# Altium schematic sheet Gas_Sampler-Vin.SchDoc: Vin
size Tabloid; Organization: Sensible Robotics LLC; Address1: 120 E Church Ave Suite B; Address2: Ridgecrest CA, 93555; Revision: 0; SheetNumber: 3; SheetTotal: 12; ApprovedBy: Approved Name; Engineer: Mike Licitra; PageSetup: Record=PageOptions|CenterHorizontal=True|CenterVertical=True|PrintScale=0.98|XCorrection=1.00|YCorrection=1.00|PrintKind=0|BorderSize=5000000|LeftOffset=0|BottomOffset=0|Orientation=2|PaperLength=1000|PaperWidth=1000|Scale=100|PaperSource=15|PrintQuality=600|MediaType=1|DitherType=10|PaperKind=Tabloid|PrintScaleMode=1
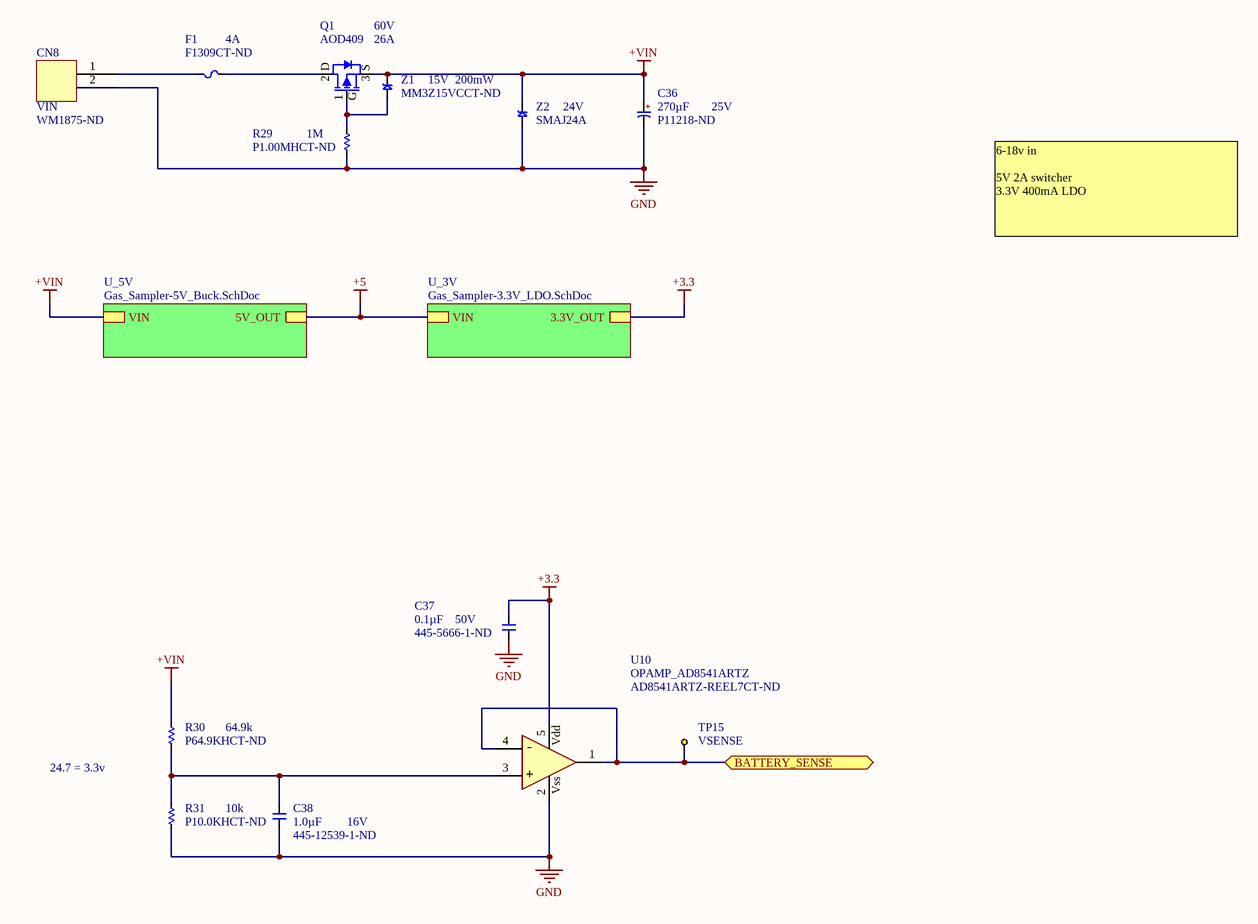
[diagram p0: Gas_Sampler-Vin.SchDoc]

## Parts
C36  value 270µF  Voltage - Rated: 25V  Supplier Part Number 1: P11218-ND  [CAP_RADIAL_10MM_DIA_12.5MM_LEN_5MM_LEADSPACE]  (hidden comment: CAP_ALUM_270UF_25V_20%_RADIAL_10X12.5MM)
C37  value 0.1µF  Voltage - Rated: 50V  Supplier Part Number 1: 445-5666-1-ND  [C0603]  (hidden comment: CAP_CER_0603_0.1UF_50V_10%_X7R)
C38  value 1.0µF  Supplier Part Number 1: 445-12539-1-ND  Voltage - Rated: 16V  [C0603]  (hidden comment: CAP_CER_0603_1UF_16V_10%_X7R)
CN8  VIN  Supplier Part Number 1: WM1875-ND  [MICROFIT_3_SINGLE_ROW_RA_TH_CLIP_2POS]
F1  Supplier Part Number 1: F1309CT-ND  Current Rating: 4A  [FUSEHOLDER_LITTLEFUSE_0154005.DR]  (hidden comment: FUSE_4A_OMNIBLOK_0154004)
Q1  Manufacturer Part Number: AOD409  Drain to Source Voltage (Vdss): 60V  Current - Continuous Drain (Id) @ 25° C: 26A  [DPAK]  (hidden comment: PFET_AOD409)
R29  value 1M  Supplier Part Number 1: P1.00MHCT-ND  [R0603]  (hidden comment: RES_0603_1M_OHM_1/10W_1%)
R30  Supplier Part Number 1: P64.9KHCT-ND  Resistance (Ohms): 64.9k  [R0603]  (hidden comment: RES_0603_64.9K_OHM_1/10W_1%)
R31  value 10k  Supplier Part Number 1: P10.0KHCT-ND  [R0603]  (hidden comment: RES_0603_10K_OHM_1/10W_1%)
TP15  VSENSE  [TP_KEYSTONE_5001]
U10  OPAMP_AD8541ARTZ  Supplier Part Number 1: AD8541ARTZ-REEL7CT-ND  [5SOT23]
Z1  Supplier Part Number 1: MM3Z15VCCT-ND  Power - Max: 200mW  Voltage - Zener (Nom) (Vz): 15V  [SOD323]  (hidden comment: ZENER_MM3Z15VC)
Z2  Voltage - Reverse Standoff (Typ): 24V  Manufacturer Part Number: SMAJ24A  [SMA]  (hidden comment: TVS_UNI_SMAJ24A)

## Sub-sheets
U_3V = Gas_Sampler-3.3V_LDO.SchDoc: VIN, 3.3V_OUT
U_5V = Gas_Sampler-5V_Buck.SchDoc: 5V_OUT, VIN

## Ports
BATTERY_SENSE

## Nets
+3.3: C37.1 U10.5(VDD) ; sheet U_3V/3.3V_OUT
+5: sheet U_5V/5V_OUT, sheet U_3V/VIN
+VIN: C36.1 Q1.3(S) R30.2 Z1.2 Z2.2 ; sheet U_5V/VIN
GND: C36.2 C37.2 C38.2 CN8.2 R29.1 R31.1 U10.2(VSS) Z2.1
BATTERY_SENSE: TP15.1 U10.1(OUT) U10.4(IN-) ; port BATTERY_SENSE
NetC38_1: C38.1 R30.1 R31.2 U10.3(IN+)
NetCN8_1: CN8.1 F1.1
NetF1_2: F1.2 Q1.2(D)
NetQ1_1: Q1.1(G) R29.2 Z1.1

## Notes on the sheet
- 6-18v in
  5V 2A switcher
  3.3V 400mA LDO
- 24.7 = 3.3v
- CONFIDENTIAL DOCUMENT
- DUPLICATION PROHIBITED
- ENGINEER
- PCB FAB #
- SCH #
- REV
- Sensible
- Robotics
- THIS DOCUMENT CONTAINS INFORMATION AND OR DATA, WHICH IS PROPRIETARY AND CONFIDENTIAL TO SENSIBLE ROBOTICS LLC.  THIS INFORMATION AND OR DATA, IS TO BE USED ONLY FOR THE BENEFIT OF THE SUPPLIER, AND IS NOT TO BE USED FOR THE BENEFIT OF OTHER PARTIES WITHOUT WRITTEN CONSENT.
- DATE
- PCB ASSY #
- SIZE
- Tabloid
- SHEET
- OF
- FILE
- (in symbol CAP_ALUM_270UF_25V_20%_RADIAL_10X12.5MM) +
- (in symbol OPAMP_AD8541ARTZ) Vdd; +; Vss

## Library data of the parts
C36 = CAP_ALUM_270UF_25V_20%_RADIAL_10X12.5MM: CAP ALUM 270UF 20% 25V RADIAL; Manufacturer: Panasonic Electronic Components; Manufacturer Part Number: EEU-FC1E271; Lifetime @ Temp.: 3000 Hrs @ 105°C; Polarization: Polar; Ripple Current - Low Frequency: 490.8mA @ 120Hz; Ripple Current - High Frequency: 755mA @ 100kHz; Supplier 1: Digi-Key; RoHS: RoHS Compliant; Category: Capacitors; Stock 1: 10830; Pricing 1: 1=0.53, 10=0.372, 100=0.2449, 500=0.18144, 1000=0.15422, 2500=0.14515, 5000=0.13608 (USD); Packaging: Bulk; Part Status: Active; Tolerance: ±20%; ESR (Equivalent Series Resistance): -; Operating Temperature: -55°C ~ 105°C; Applications: Automotive; Lead Spacing: 0.197" (5.00mm); Size / Dimension: 0.394" Dia (10.00mm); Height - Seated (Max): 0.492" (12.50mm); Mounting Type: Through Hole; Package / Case: Radial, Can; ComponentLink1URL: http://industrial.panasonic.com/www-cgi/jvcr13pz.cgi?E+PZ+3+ABA0022+EEUFC1E271+7+WW; ComponentLink1Description: http://industrial.panasonic.com/www-cgi/jvcr13pz.cgi?E+PZ+3+ABA0022+EEUFC1E271+7+WW
C37 = CAP_CER_0603_0.1UF_50V_10%_X7R: CAP CER 0.1UF 50V 10% X7R 0603; Manufacturer: TDK Corporation; Manufacturer Part Number: CGA3E2X7R1H104K080AA; Part Number: 150-00077-00; Supplier 1: Digi-Key; RoHS: RoHS Compliant; Category: Capacitors; Stock 1: 320000; Pricing 1: 1=0.1, 10=0.072, 100=0.033, 250=0.027, 500=0.0231, 1000=0.018 (USD); Packaging: Cut Tape (CT); Tolerance: ±10%; Temperature Coefficient: X7R; Mounting Type: Surface Mount, MLCC; Operating Temperature: -55°C ~ 125°C; Applications: Automotive; Ratings: AEC-Q200; Package / Case: 0603 (1608 Metric); Size / Dimension: 0.063" L x 0.031" W (1.60mm x 0.80mm); Height - Seated (Max): -; Thickness (Max): 0.035" (0.90mm); Lead Spacing: -; Features: -; Lead Style: -; ComponentLink1URL: http://product.tdk.com/capacitor/mlcc/en/documents/mlcc_automotive_general_en.pdf; ComponentLink1Description: http://product.tdk.com/capacitor/mlcc/en/documents/mlcc_automotive_general_en.pdf
C38 = CAP_CER_0603_1UF_16V_10%_X7R: CAP CER 1UF 16V 10% X7R 0603; Manufacturer: TDK Corporation; Manufacturer Part Number: CGA3E1X7R1C105K080AC; Supplier 1: Digi-Key; RoHS: RoHS Compliant; Packaging: Cut Tape (CT); Tolerance: ±10%; Temperature Coefficient: X7R; Mounting Type: Surface Mount, MLCC; Operating Temperature: -55°C ~ 125°C; Applications: Automotive; Ratings: AEC-Q200; Package / Case: 0603 (1608 Metric); Size / Dimension: 0.063" L x 0.031" W (1.60mm x 0.80mm); Thickness (Max): 0.035" (0.90mm); ComponentLink1URL: http://product.tdk.com/capacitor/mlcc/en/documents/mlcc_automotive_general_en.pdf; ComponentLink1Description: http://product.tdk.com/capacitor/mlcc/en/documents/mlcc_automotive_general_en.pdf
CN8 = MICROFIT_3_SINGLE_ROW_RA_TH_CLIP_2POS: CONN HEADER 2POS R/A W/CLIP GOLD; Manufacturer: Molex Connector Corporation; Manufacturer Part Number: 43650-0204; Connector Type: Header, Shrouded; Number of Positions: 2; Number of Positions Loaded: All; Pitch: 0.118" (3.00mm); Supplier 1: Digi-Key; RoHS: RoHS Compliant; Packaging: Tray; Contact Type: Male Pin; Number of Rows: 1; Mounting Type: Through Hole, Right Angle; Termination: Solder; Fastening Type: Locking Ramp; Features: Board Lock; Contact Finish: Gold; Contact Finish Thickness: 15µin (0.38µm); Color: Black; ComponentLink1URL: http://www.molex.com/pdm_docs/sd/436500204_sd.pdf; ComponentLink1Description: http://www.molex.com/pdm_docs/sd/436500204_sd.pdf
F1 = FUSE_4A_OMNIBLOK_0154004: FUSE Slow 125VAC, 125VDC 4A SMD; Manufacturer: Littelfuse Inc; Manufacturer Part Number: 0154004.DRT; Part Number: 430-00077-00; Fuse Type: Board Mount (Cartridge Style Excluded); Voltage Rating - AC: 125V; Breaking Capacity @ Rated Voltage: 50A; Melting I²t: 34.4; Approvals: PSE, UL; Color: White; DC Cold Resistance: 0.0186 Ohm; Supplier 1: Digi-Key; RoHS: RoHS Compliant; Category: Circuit Protection; Stock 1: 4331; Pricing 1: 1=3.07, 10=2.781, 25=2.632, 50=2.2414, 100=1.8972, 250=1.85072, 500=1.5624 (USD); Voltage Rating - DC: 125V; Response Time: Slow; Package / Case: 2-SMD, Square End Block with Holder; Mounting Type: Holder/Surface Mount; Operating Temperature: -55°C ~ 125°C; Size / Dimension: 0.383" L x 0.198" W x 0.150" H (9.73mm x 5.03mm x 3.81mm); Packaging: Cut Tape (CT); ComponentLink1URL: http://www.littelfuse.com/products/fuse-blocks-fuseholders-and-fuse-accessories/fuse-blocks/~/media/Files/Littelfuse/Technical%20Resources/Documents/Data%20Sheets/Littelfuse_Fuseblocks_154_155_Datasheet.pdf; ComponentLink1Description: Datasheet
Q1 = PFET_AOD409: MOSFET P-CH -60V -26A TO-252; Manufacturer: Alpha & Omega Semiconductor Inc; FET Type: MOSFET P-Channel, Metal Oxide; FET Feature: Logic Level Gate; Rds On (Max) @ Id, Vgs: 40 mOhm @ 20A, 10V; Vgs(th) (Max) @ Id: 2.4V @ 250µA; Gate Charge (Qg) @ Vgs: 54nC @ 10V; Input Capacitance (Ciss) @ Vds: 3600pF @ 30V; Power - Max: 60W; Supplier 1: Digi-Key; RoHS: RoHS Compliant; Category: Discrete Semiconductor Products; Stock 1: 20027; Pricing 1: 1=0.97, 25=0.7516, 100=0.663, 250=0.5746, 500=0.4862, 1000=0.38675 (USD); Mounting Type: Surface Mount; Package / Case: TO-252-3, DPak (2 Leads + Tab), SC-63; Supplier Device Package: TO-252, (D-Pak); Packaging: Cut Tape (CT); ComponentLink1URL: http://www.aosmd.com/res/data_sheets/AOD409.pdf; ComponentLink1Description: Datasheet; Supplier Part Number 1: 785-1103-1-ND
R29 = RES_0603_1M_OHM_1/10W_1%: RES 1M OHM 1/10W 1% 0603 SMD; Manufacturer: Panasonic Electronic Components; Manufacturer Part Number: ERJ-3EKF1004V; Power (Watts): 0.1W, 1/10W; Temperature Coefficient: ±100ppm/°C; Supplier 1: Digi-Key; RoHS: RoHS Compliant; Category: Resistors; Stock 1: 1614014; Pricing 1: 1=0.1, 50=0.0138, 100=0.0105, 250=0.0078, 500=0.00576, 1000=0.00384 (USD); Packaging: Cut Tape (CT); Composition: Thick Film; Features: -; Tolerance: ±1%; Package / Case: 0603 (1608 Metric); Supplier Device Package: 0603; Size / Dimension: 0.063" L x 0.031" W (1.60mm x 0.80mm); Height: 0.022" (0.55mm); Number of Terminations: 2; ComponentLink1URL: http://industrial.panasonic.com/www-cgi/jvcr13pz.cgi?E+PZ+3+AOA0002+ERJ3EKF1004V+7+WW; ComponentLink1Description: http://industrial.panasonic.com/www-cgi/jvcr13pz.cgi?E+PZ+3+AOA0002+ERJ3EKF1004V+7+WW
R30 = RES_0603_64.9K_OHM_1/10W_1%: RES 64.9K OHM 1% 1/10W 0603; Manufacturer: Panasonic Electronic Components; Manufacturer Part Number: ERJ3EKF6492V; Part Number: 470-02041-00; Power (Watts): 0.1W, 1/10W; Temperature Coefficient: ±100ppm/°C; Supplier 1: Digi-Key; RoHS: RoHS Compliant; Category: Resistors; Stock 1: 97260; Pricing 1: 1=0.1, 50=0.0114, 100=0.0084, 250=0.00644, 500=0.00514, 1000=0.00379 (USD); Packaging: Cut Tape (CT); Composition: Thick Film; Features: Automotive AEC-Q200; Operating Temperature: -55°C ~ 155°C; Package / Case: 0603 (1608 Metric); Supplier Device Package: 0603; Size / Dimension: 0.063" L x 0.031" W (1.60mm x 0.80mm); Height: 0.022" (0.55mm); Number of Terminations: 2; ComponentLink1URL: http://industrial.panasonic.com/www-cgi/jvcr13pz.cgi?E+PZ+3+AOA0002+ERJ3EKF6492V+7+WW; ComponentLink1Description: http://industrial.panasonic.com/www-cgi/jvcr13pz.cgi?E+PZ+3+AOA0002+ERJ3EKF6492V+7+WW; Tolerance: ±1%
R31 = RES_0603_10K_OHM_1/10W_1%: RES 10K OHM 1/10W 1% 0603 SMD; Manufacturer: Panasonic Electronic Components; Manufacturer Part Number: ERJ-3EKF1002V; Power (Watts): 0.1W, 1/10W; Temperature Coefficient: ±100ppm/°C; Supplier 1: Digi-Key; RoHS: RoHS Compliant; Packaging: Cut Tape (CT); Composition: Thick Film; Tolerance: ±1%; Package / Case: 0603 (1608 Metric); Supplier Device Package: 0603; Size / Dimension: 0.063" L x 0.031" W (1.60mm x 0.80mm); Height: 0.022" (0.55mm); Number of Terminations: 2; ComponentLink1URL: http://industrial.panasonic.com/www-cgi/jvcr13pz.cgi?E+PZ+3+AOA0002+ERJ3EKF1002V+7+WW; ComponentLink1Description: http://industrial.panasonic.com/www-cgi/jvcr13pz.cgi?E+PZ+3+AOA0002+ERJ3EKF1002V+7+WW
TP15 = TEST_KEYSTONE5001: PC TEST POINT TH RING; Manufacturer: Keystone Electronics; Manufacturer Part Number: 5001; Part Number: 250-00184-00; Supplier 1: Digi-Key; Supplier Part Number 1: 5001K-ND; RoHS: RoHS Compliant; Category: Test and Measurement; Stock 1: 341830; Pricing 1: 1=0.33, 10=0.309, 50=0.2252, 100=0.2164, 250=0.19432, 500=0.18548, 1000=0.15456, 2500=0.14131, 5000=0.13248 (USD); Packaging: Bulk; Type: PC Test Point, Miniature; Terminal: 0.010" x 0.020" (0.25mm x 0.51mm) Phosphor Bronze Wire, Silver Plate; Mounting Type: 0.040" (1.02mm) Hole Diameter; Material: Base, Nylon 46, UL 94V-0; Color: Black; ComponentLink1URL: http://www.keyelco.com/product-pdf.cfm?p=1310; ComponentLink1Description: http://www.keyelco.com/product-pdf.cfm?p=1310
U10 = OPAMP_AD8541ARTZ: IC OPAMP GP R-R CMOS SOT23-5; Manufacturer: Analog Devices Inc; Manufacturer Part Number: AD8541ARTZ-REEL7; Part Number: 480-00120-00; Amplifier Type: General Purpose; Number of Circuits: 1; Output Type: Rail-to-Rail; Slew Rate: 0.92 V/µs; Gain Bandwidth Product: 1MHz; Current - Input Bias: 4pA; Voltage - Input Offset: 1mV; Current - Supply: 45µA; Current - Output / Channel: 30mA; Voltage - Supply, Single/Dual (±): 2.7 V ~ 5.5 V; Supplier 1: Digi-Key; RoHS: RoHS Compliant; Category: Integrated Circuits (ICs); Stock 1: 26612; Pricing 1: 1=0.85, 10=0.747, 25=0.6604, 100=0.5755, 250=0.50096, 500=0.42642, 1000=0.34155 (USD); Packaging: Cut Tape (CT); -3db Bandwidth: -; Operating Temperature: -40°C ~ 125°C; Mounting Type: Surface Mount; Package / Case: SC-74A, SOT-753; Supplier Device Package: SOT-23-5; ComponentLink1URL: http://www.analog.com/static/imported-files/data_sheets/AD8541_8542_8544.pdf; ComponentLink1Description: http://www.analog.com/static/imported-files/data_sheets/AD8541_8542_8544.pdf
Z1 = ZENER_MM3Z15VC: DIODE ZENER 15V 200MW SOD; Manufacturer: Fairchild Semiconductor; Part Number: 480-00176-00; Voltage - Forward (Vf) (Max) @ If: 1V @ 10mA; Current - Reverse Leakage @ Vr: 45nA @ 10.5V; Impedance (Max) (Zzt): 28 Ohm; Tolerance: ±5%; Supplier 1: Digi-Key; Manufacturer Part Number: MM3Z15VC; RoHS: RoHS Compliant; Category: Discrete Semiconductor Products; Stock 1: 30597; Pricing 1: 1=0.44, 10=0.29, 100=0.126, 250=0.08192, 500=0.05796, 750=0.04788, 1000=0.04095 (USD); Mounting Type: Surface Mount; Package / Case: SC-90, SOD-323F; Supplier Device Package: SOD-323F; Packaging: Cut Tape (CT); Operating Temperature: -65°C ~ 150°C; ComponentLink1URL: http://www.fairchildsemi.com/ds/MM/MM3Z10VC.pdf; ComponentLink1Description: Datasheet
Z2 = TVS_UNI_SMAJ24A: TVS DIODE 24VWM SMD; Manufacturer: Bourns Inc.; Part Number: 430-00161-00; Unidirectional Channels: 1; Voltage - Breakdown (Min): 26.7V; Power - Peak Pulse: 400W; Power Line Protection: No; Supplier 1: Digi-Key; Supplier Part Number 1: SMAJ24ABCT-ND; RoHS: RoHS Compliant; Category: Circuit Protection; Stock 1: 27086; Pricing 1: 1=0.53, 10=0.377, 25=0.3096, 100=0.2473, 250=0.1802, 500=0.14632, 1000=0.11248, 2500=0.10101 (USD); Packaging: Cut Tape (CT); Type: Zener; Bidirectional Channels: -; Voltage - Clamping (Max) @ Ipp: -; Current - Peak Pulse (10/1000µs): -; Applications: General Purpose; Capacitance @ Frequency: -; Operating Temperature: -55°C ~ 150°C (TJ); Mounting Type: Surface Mount; Package / Case: DO-214AC, SMA; Supplier Device Package: SMA (DO-214AC); ComponentLink1URL: http://www.bourns.com/data/global/pdfs/SMAJ.pdf; ComponentLink1Description: http://www.bourns.com/data/global/pdfs/SMAJ.pdf